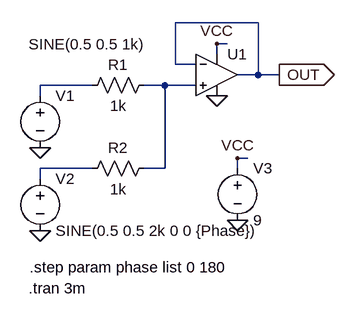
[diagram p0: schematic Nucleo_DCO_Mix.asc]
Nucleo_DCO_Mix.asc, the LTspice schematic file:
Version 4
SHEET 1 924 680
WIRE 432 -32 304 -32
WIRE 384 0 368 0
WIRE 368 16 368 0
WIRE 304 32 304 -32
WIRE 336 32 304 32
WIRE 432 48 432 -32
WIRE 432 48 400 48
WIRE 464 48 432 48
WIRE 176 64 96 64
WIRE 288 64 256 64
WIRE 336 64 288 64
WIRE 96 80 96 64
WIRE 416 176 400 176
WIRE 176 192 96 192
WIRE 288 192 288 64
WIRE 288 192 256 192
WIRE 400 192 400 176
WIRE 96 208 96 192
FLAG 96 160 0
FLAG 96 288 0
FLAG 368 80 0
FLAG 368 0 VCC
FLAG 464 48 OUT
IOPIN 464 48 Out
FLAG 400 272 0
FLAG 400 176 VCC
SYMBOL voltage 96 64 R0
WINDOW 3 -18 -63 Left 2
WINDOW 123 0 0 Left 2
WINDOW 39 0 0 Left 2
SYMATTR InstName V1
SYMATTR Value SINE(0.5 0.5 1k)
SYMBOL voltage 96 192 R0
WINDOW 123 0 0 Left 2
WINDOW 39 0 0 Left 2
SYMATTR InstName V2
SYMATTR Value SINE(0.5 0.5 2k 0 0 {Phase})
SYMBOL res 272 48 R90
WINDOW 0 0 56 VBottom 2
WINDOW 3 32 56 VTop 2
SYMATTR InstName R1
SYMATTR Value 1k
SYMBOL res 272 176 R90
WINDOW 0 0 56 VBottom 2
WINDOW 3 32 56 VTop 2
SYMATTR InstName R2
SYMATTR Value 1k
SYMBOL Opamps\\UniversalOpamp2 368 48 R0
SYMATTR InstName U1
SYMBOL voltage 400 176 R0
WINDOW 123 0 0 Left 2
WINDOW 39 0 0 Left 2
SYMATTR InstName V3
SYMATTR Value 9
TEXT 78 376 Left 2 !.tran 3m
TEXT 80 344 Left 2 !.step param phase list 0 180

The netlist it stands for:
* Nucleo_DCO_Mix.asc
V1 N001 0 SINE(0.5 0.5 1k)
V2 N003 0 SINE(0.5 0.5 2k 0 0 {Phase})
R1 N002 N001 1k
R2 N002 N003 1k
XU1 N002 OUT VCC 0 OUT level.2 Avol=1Meg GBW=10Meg Slew=10Meg ilimit=25m rail=0 Vos=0 phimargin=45 en=0 enk=0 in=0 ink=0 Rin=500Meg  ; pins IN+ IN- V+ V- OUT
V3 VCC 0 9
.tran 3m
.step param phase list 0 180
.lib UniversalOpamps2.sub
.backanno
.end